# Altium schematic sheet global.SchDoc
size A4
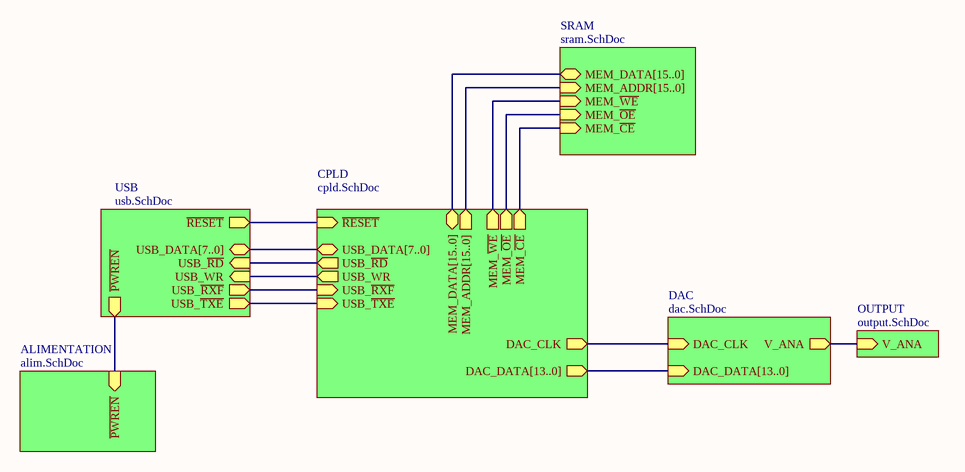
[diagram p0: global.SchDoc]

## Sub-sheets
ALIMENTATION = alim.SchDoc: ~{PWREN} (in)
CPLD = cpld.SchDoc: ~{RESET} (in), DAC_DATA[13..0] (out), USB_DATA[7..0] (bidir), USB_~{RD} (out), USB_WR (out), USB_~{RXF} (in), USB_~{TXE} (in), MEM_ADDR[15..0] (out), MEM_~{WE} (out), MEM_~{OE} (out), MEM_~{CE} (out), DAC_CLK (out), MEM_DATA[15..0] (bidir)
DAC = dac.SchDoc: V_ANA (out), DAC_DATA[13..0] (in), DAC_CLK (in)
OUTPUT = output.SchDoc: V_ANA (in)
SRAM = sram.SchDoc: MEM_DATA[15..0] (bidir), MEM_ADDR[15..0] (in), MEM_~{WE} (in), MEM_~{OE} (in), MEM_~{CE} (in)
USB = usb.SchDoc: ~{PWREN} (out), ~{RESET} (out), USB_DATA[7..0] (bidir), USB_~{RD} (in), USB_WR (in), USB_~{TXE} (out), USB_~{RXF} (out)

## Nets
(unnamed): sheet USB/~{PWREN}, sheet ALIMENTATION/~{PWREN}
(unnamed): sheet USB/~{RESET}, sheet CPLD/~{RESET}
(unnamed): sheet USB/USB_~{RD}, sheet CPLD/USB_~{RD}
(unnamed): sheet USB/USB_WR, sheet CPLD/USB_WR
(unnamed): sheet USB/USB_~{TXE}, sheet CPLD/USB_~{TXE}
(unnamed): sheet USB/USB_~{RXF}, sheet CPLD/USB_~{RXF}
(unnamed): sheet CPLD/MEM_~{WE}, sheet SRAM/MEM_~{WE}
(unnamed): sheet CPLD/MEM_~{OE}, sheet SRAM/MEM_~{OE}
(unnamed): sheet CPLD/MEM_~{CE}, sheet SRAM/MEM_~{CE}
(unnamed): sheet CPLD/DAC_CLK, sheet DAC/DAC_CLK
(unnamed): sheet DAC/V_ANA, sheet OUTPUT/V_ANA

## Buses and harness runs
bus sheet CPLD/DAC_DATA[13..0] = sheet DAC/DAC_DATA[13..0]
bus sheet CPLD/MEM_ADDR[15..0] = sheet SRAM/MEM_ADDR[15..0]
bus sheet CPLD/MEM_DATA[15..0] = sheet SRAM/MEM_DATA[15..0]
bus sheet CPLD/USB_DATA[7..0] = sheet USB/USB_DATA[7..0]